# EAGLE schematic circuito_tesi (EAGLE 9.6.2)
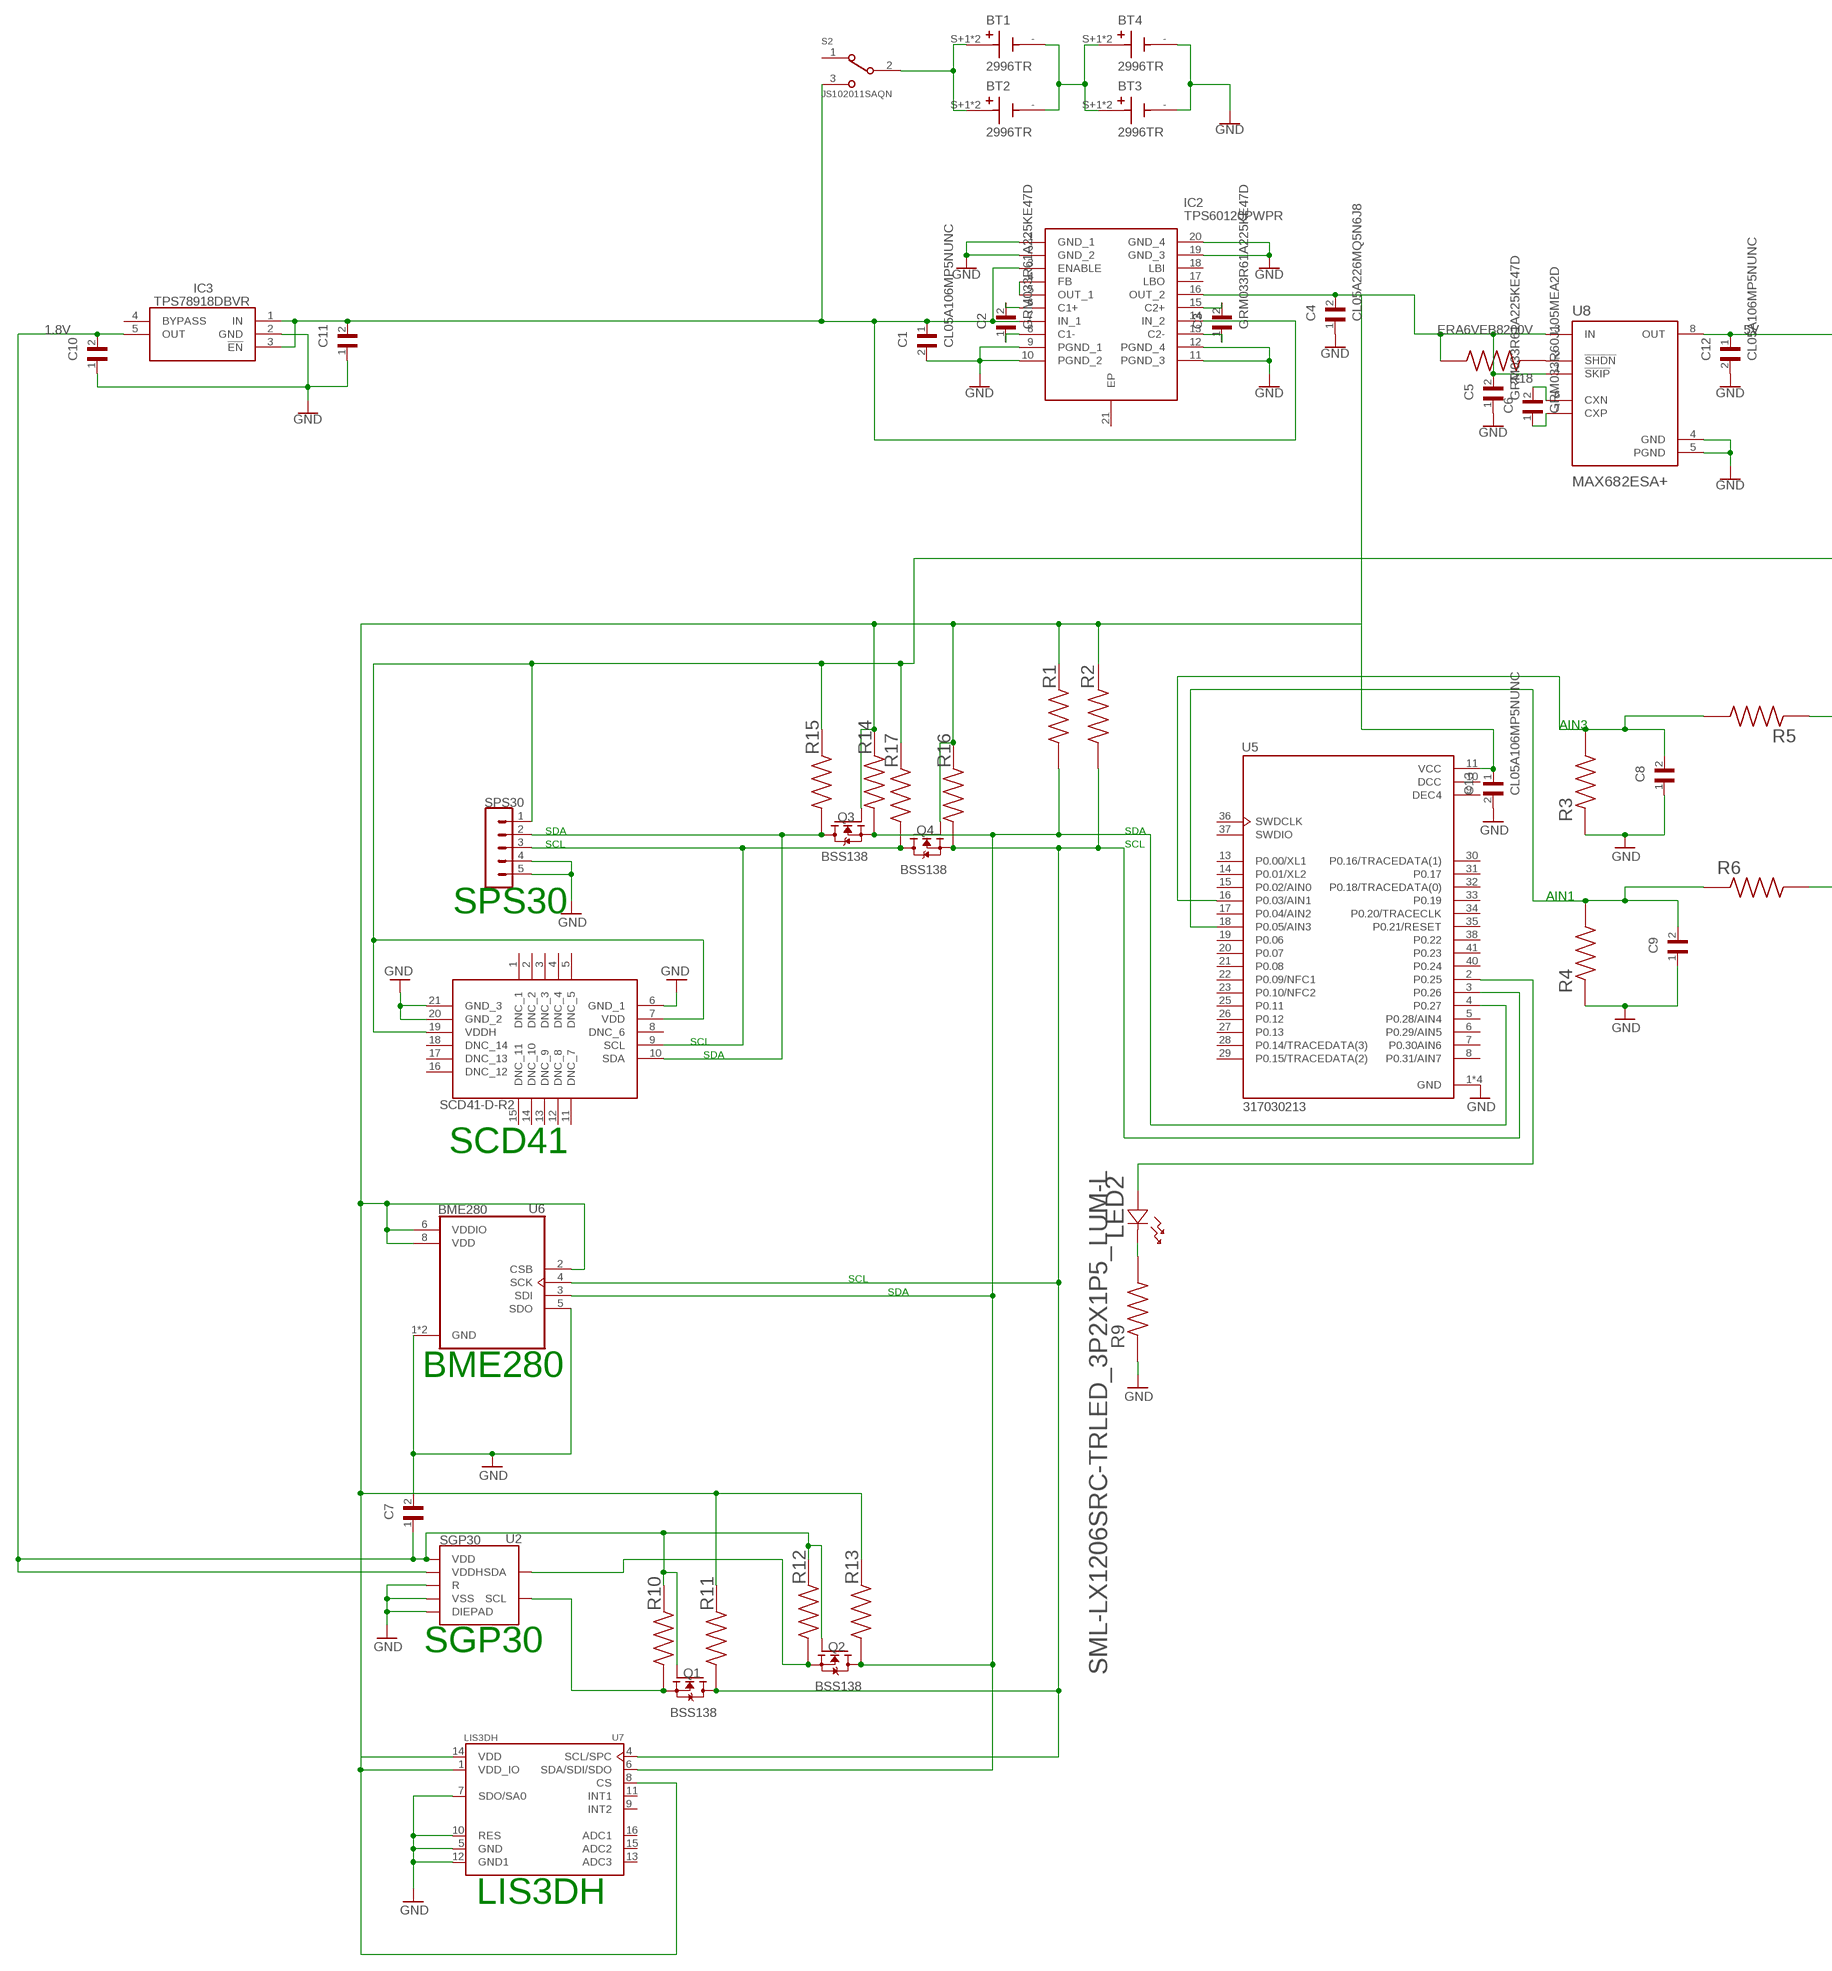
[diagram p0: schematic, sheet 1, part 1 of 2]
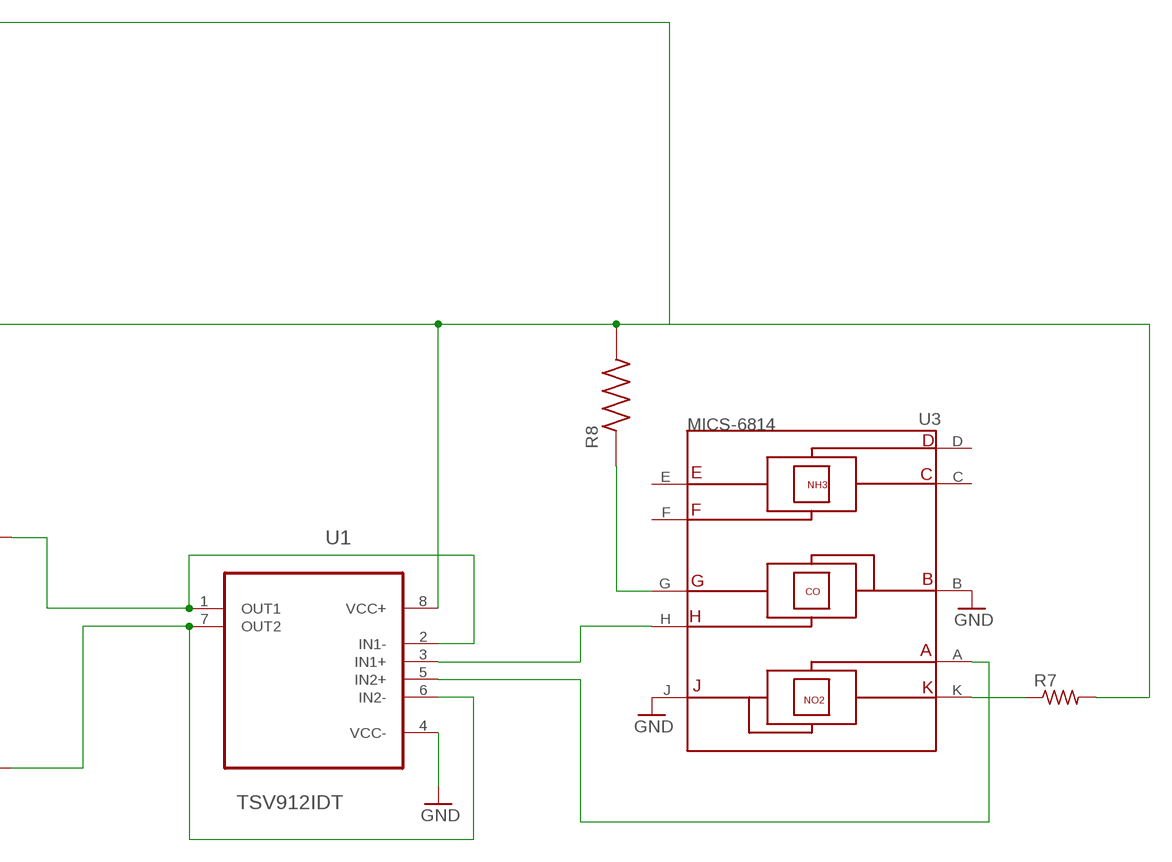
[diagram p1: schematic, sheet 1, part 2 of 2]

## Parts
BT1  2996TR  [BAT_2996TR]
BT2  2996TR  [BAT_2996TR]
BT3  2996TR  [BAT_2996TR]
BT4  2996TR  [BAT_2996TR]
C1  CL05A106MP5NUNC  [CAPC1005X55N]
C2  GRM033R61A225KE47D  [CAPC0603X39N]
C3  GRM033R61A225KE47D  [CAPC0603X39N]
C4  CL05A226MQ5N6J8  [CAPC1005X55N]
C5  GRM033R61A225KE47D  [CAPC0603X39N]
C6  GRM033R60J105MEA2D  [CAPC0603X35N]
C7  GRM033C80J104KE15D  [CAPC0603X33N]
C8  GRM033R60J103KA01D  [CAPC0603X33N]
C9  GRM033R60J103KA01D  [CAPC0603X33N]
C10  GRM033R60J105MEA2D  [CAPC0603X35N]
C11  GRM033R60J105MEA2D  [CAPC0603X35N]
C12  CL05A106MP5NUNC  [CAPC1005X55N]
C13  CL05A106MP5NUNC  [CAPC1005X55N]
IC1  SCD41-D-R2  [SCD41DR2]
IC2  TPS60120PWPR  [SOP65P640X120-21N]
IC3  TPS78918DBVR  [SOT95P280X145-5N]
LED2  SML-LX1206SRC-TRLED_3P2X1P5_LUM-L  [LED_3P2X1P5_LUM-L]
Q1  BSS138  [SOT95P240X111-3N]
Q2  BSS138  [SOT95P240X111-3N]
Q3  BSS138  [SOT95P240X111-3N]
Q4  BSS138  [SOT95P240X111-3N]
R1  RNCP0805FTD10K0  [RESC2012X60N]
R2  RNCP0805FTD10K0  [RESC2012X60N]
R3  RMCF0603FT10M0  [RESC1508X55N]
R4  RMCF0603FT10M0  [RESC1508X55N]
R5  RMCF0603FT5M10  [RESC1508X55N]
R6  RMCF0603FT5M10  [RESC1508X55N]
R7  RP73PF2A130RBTDF  [RESC2012X65N]
R8  ERA6VEB8200V  [RES_ERA6VEB8200V]
R9  RNCF0603DTE820R  [RESC1508X55N]
R10  RNCP0805FTD10K0  [RESC2012X60N]
R11  RNCP0805FTD10K0  [RESC2012X60N]
R12  RNCP0805FTD10K0  [RESC2012X60N]
R13  RNCP0805FTD10K0  [RESC2012X60N]
R14  RNCP0805FTD10K0  [RESC2012X60N]
R15  RNCP0805FTD10K0  [RESC2012X60N]
R16  RNCP0805FTD10K0  [RESC2012X60N]
R17  RNCP0805FTD10K0  [RESC2012X60N]
R18  ERA6VEB8200V  [RES_ERA6VEB8200V]
S2  JS102011SAQN  [SW_JS102011SAQN]
SPS30  MA05-1  [MA05-1]
U1  TSV912IDT  [SOIC127P600X175-8N]
U2  SGP30  [SGP30]
U3  MICS-6814  [SENSOR_MICS-6814]
U5  317030213  [XCVR_317030213]
U6  BME280  [PSON65P250X250X100-8N]
U7  LIS3DH  [PQFN50P300X300X100-16N]
U8  MAX682ESA+  [SOIC127P600X175-8N]

## Nets
1.8V: C7.1 C10.2 IC3.5(OUT) Q1.1(G) Q2.1(G) R10.2 R12.2 U2.1(VDD) U2.5(VDDH)
3.3: C4.2 C5.2 C13.1 IC2.16(OUT_2) Q3.1(G) Q4.1(G) R1.2 R2.2 R11.2 R13.2 R14.2 R16.2 R18.2 U5.11(VCC) U6.2(CSB) U6.6(VDDIO) U6.8(VDD) U7.1(VDD_IO) U7.8(CS) U7.14(VDD) U8.1(!SKIP) U8.3(IN)
5V: C12.1 IC1.7(VDD) IC1.19(VDDH) R7.2 R8.2 R15.2 R17.2 SPS30.1 U1.8(VCC+) U8.8(OUT)
GND: BT3.- BT4.- C1.2 C4.1 C5.1 C7.2 C8.1 C9.1 C10.1 C11.1 C12.2 C13.2 IC1.6(GND_1) IC1.20(GND_2) IC1.21(GND_3) IC2.1(GND_1) IC2.2(GND_2) IC2.9(PGND_1) IC2.10(PGND_2) IC2.11(PGND_3) IC2.12(PGND_4) IC2.19(GND_3) IC2.20(GND_4) IC3.2(GND) R3.1 R4.1 R9.1 SPS30.4 SPS30.5 U1.4(VCC-) U2.2(VSS) U2.4(R) U2.DIEPAD U3.B(RH1/RS1_RED) U3.J(RH1/RS1_OX) U5.1(GND) U5.12(GND) U5.24(GND) U5.39(GND) U6.1(GND) U6.5(SDO) U6.7(GND) U7.5(GND) U7.7(SDO/SA0) U7.10(RES) U7.12(GND1) U8.4(GND) U8.5(PGND)
N$1: IC1.10(SDA) Q3.3(D) R15.1 SPS30.2
N$2: BT1.S+1(+) BT1.S+2(+) BT2.S+1(+) BT2.S+2(+) S2.2
N$3: IC1.9(SCL) Q4.3(D) R17.1 SPS30.3
N$4: BT1.- BT2.- BT3.S+1(+) BT3.S+2(+) BT4.S+1(+) BT4.S+2(+)
N$5: R6.2 U1.6(IN2-) U1.7(OUT2)
N$6: U1.5(IN2+) U3.A(RS2)
N$7: C2.2 IC2.6(C1+)
N$8: R5.1 U1.1(OUT1) U1.2(IN1-)
N$9: LED2.1(ANODE) R9.2
N$10: U1.3(IN1+) U3.H(RS2_RED)
N$11: R8.1 U3.G(RH2_RED)
N$12: C2.1 IC2.8(C1-)
N$13: R7.1 U3.K(RH2_OX)
N$14: C3.2 IC2.15(C2+)
N$15: C9.2 R4.2 R6.1 U5.18(P0.05/AIN3)
N$16: Q2.2(S) R12.1 U2.3(SDA)
N$17: C8.2 R3.2 R5.2 U5.16(P0.03/AIN1)
N$18: C3.1 IC2.13(C2-)
N$19: IC2.4(FB) IC2.5(OUT_1)
N$20: C6.2 U8.6(CXN)
N$21: LED2.2(CATHODE) U5.2(P0.25)
N$22: C6.1 U8.7(CXP)
N$23: Q1.2(S) R10.1 U2.6(SCL)
N$24: R18.1 U8.2(!SHDN)
SCL: Q1.3(D) Q4.2(S) R2.1 R11.1 R16.1 U5.3(P0.26) U6.4(SCK) U7.4(SCL/SPC)
SDA: Q2.3(D) Q3.2(S) R1.1 R13.1 R14.1 U5.4(P0.27) U6.3(SDI) U7.6(SDA/SDI/SDO)
VDD: C1.1 C11.2 IC2.3(ENABLE) IC2.7(IN_1) IC2.14(IN_2) IC3.1(IN) IC3.3(!EN) S2.3
Unconnected: IC1.1(DNC_1) IC1.2(DNC_2) IC1.3(DNC_3) IC1.4(DNC_4) IC1.5(DNC_5) IC1.8(DNC_6) IC1.11(DNC_7) IC1.12(DNC_8) IC1.13(DNC_9) IC1.14(DNC_10) IC1.15(DNC_11) IC1.16(DNC_12) IC1.17(DNC_13) IC1.18(DNC_14) IC2.17(LBO) IC2.18(LBI) IC2.21(EP) IC3.4(BYPASS) S2.1 U3.C(RH1_NH3) U3.D(RS1_NH3) U3.E(RH2_NH3) U3.F(RS2_NH3) U5.5(P0.28/AIN4) U5.6(P0.29/AIN5) U5.7(P0.30AIN6) U5.8(P0.31/AIN7) U5.13(P0.00/XL1) U5.14(P0.01/XL2) U5.15(P0.02/AIN0) U5.17(P0.04/AIN2) U5.19(P0.06) U5.20(P0.07) U5.21(P0.08) U5.22(P0.09/NFC1) U5.23(P0.10/NFC2) U5.25(P0.11) U5.26(P0.12) U5.27(P0.13) U5.28(P0.14/TRACEDATA(3)) U5.29(P0.15/TRACEDATA(2)) U5.30(P0.16/TRACEDATA(1)) U5.31(P0.17) U5.32(P0.18/TRACEDATA(0)) U5.33(P0.19) U5.34(P0.20/TRACECLK) U5.35(P0.21/RESET) U5.36(SWDCLK) U5.37(SWDIO) U5.38(P0.22) U5.40(P0.24) U5.41(P0.23) U7.9(INT2) U7.11(INT1) U7.13(ADC3) U7.15(ADC2) U7.16(ADC1)

## Notes on the sheet
- AIN3
- SDA | SDA
- SCL | SCL
- AIN1
- SPS30
- SCL
- SDA
- SCD41
- SCL
- SDA
- BME280
- SGP30
- LIS3DH

## Power pins joined to a net without a drawn wire
DCC: U5.10(DCC)
DEC4: U5.9(DEC4)

## Library data of the parts
BT1-BT4 = Battery_holder:2996TR: Battery Retainer Coin, 11.6mm 1 Cell SMD (SMT) Tab; DESCRIPTION: SMT Holder for 11.6mm Cell-Tin Nickel Plated on T&R; DIGI-KEY_PART_NUMBER: 36-2996TR-ND; MF: Keystone Electronics; MP: 2996TR; PACKAGE: None; PURCHASE-URL: https://pricing.snapeda.com/search/part/2996TR/?ref=eda
C1 C12 C13 = Condens_10uF:CL05A106MP5NUNC: Cap Ceramic 10uF 10V X5R 20% SMD 0402 85C T/R; DESCRIPTION: 10 µF ±20% 10V Ceramic Capacitor X5R 0402 (1005 Metric); DIGI-KEY_PART_NUMBER: 1276-1450-2-ND; MF: Samsung; MP: CL05A106MP5NUNC; PACKAGE: 0402 Samsung; PURCHASE-URL: https://pricing.snapeda.com/search/part/CL05A106MP5NUNC/?ref=eda
C2 C3 C5 = Condens_2.2uF:GRM033R61A225KE47D: SMD Capacitor X5R(EIA) with Capacitance: 2.2uF Tol. 10%. Rated Voltage: 10Vdc; DESCRIPTION: 2.2 µF ±10% 10V Ceramic Capacitor X5R 0201 (0603 Metric); DIGI-KEY_PART_NUMBER: 490-13227-2-ND; MF: Murata Electronics; MP: GRM033R61A225KE47D; PACKAGE: None; PURCHASE-URL: https://pricing.snapeda.com/search/part/GRM033R61A225KE47D/?ref=eda
C4 = Condens_22uF:CL05A226MQ5N6J8: Cap Ceramic 22uF 6.3V X5R 20% Pad SMD 0402 85C T/R; DESCRIPTION: 22 µF ±20% 6.3V Ceramic Capacitor X5R 0402 (1005 Metric); DIGI-KEY_PART_NUMBER: 1276-7090-2-ND; MF: Samsung Electro-Mechanics; MP: CL05A226MQ5N6J8; PACKAGE: 0402 Samsung Electro-Mechanics; PURCHASE-URL: https://pricing.snapeda.com/search/part/CL05A226MQ5N6J8/?ref=eda
C6 C10 C11 = Condens_1uF:GRM033R60J105MEA2D: SMD Capacitor X5R(EIA) with Capacitance: 1.0uF Tol. 20%. Rated Voltage: 6.3Vdc; DESCRIPTION: SMD capacitor X5R(EIA) with capacitance 1.0uF Tol.20%. Rated voltage 6.3Vdc 85C; DIGI-KEY_PART_NUMBER: 490-7229-2-ND; MF: Murata; MP: GRM033R60J105MEA2D; PACKAGE: 0603 Taiyo Yuden; PURCHASE-URL: https://pricing.snapeda.com/search/part/GRM033R60J105MEA2D/?ref=eda
C7 = Condens_100nF:GRM033C80J104KE15D: SMD Capacitor X6S(EIA) with Capacitance: 0.10uF Tol. 10%. Rated Voltage: 6.3Vdc; DESCRIPTION: SMD capacitor X6S(EIA) with capacitance 0.10uF Tol.10%. Rated voltage 6.3Vdc 105C; DIGI-KEY_PART_NUMBER: 490-10390-2-ND; MF: Murata Electronics; MP: GRM033C80J104KE15D; PACKAGE: 0603 Taiyo Yuden; PURCHASE-URL: https://pricing.snapeda.com/search/part/GRM033C80J104KE15D/?ref=eda
C8 C9 = Condens_10nF:GRM033R60J103KA01D: SMD Capacitor X5R(EIA) with Capacitance: 10000pF Tol. 10%. Rated Voltage: 6.3Vdc; DESCRIPTION: SMD capacitor X5R(EIA) with capacitance 10000pF Tol.10%. Rated voltage 6.3Vdc 85C; DIGI-KEY_PART_NUMBER: 490-5403-2-ND; MF: Murata; MP: GRM033R60J103KA01D; PACKAGE: 0603 Taiyo Yuden; PURCHASE-URL: https://pricing.snapeda.com/search/part/GRM033R60J103KA01D/?ref=eda
IC1 = SCD41-R2_unofficial:SCD41-D-R2: Air Quality Sensor CO2 Sensor 2.5V/3.3V/5V 20-Pin SMD EP Source: Datasheet <https://cz.mouser.com/datasheet/2/682/Sensirion_CO2_Sensors_SCD4x_Datasheet-2010009.pdf>; ARROW_PART_NUMBER: SCD41-D-R2; ARROW_PRICE-STOCK: https://www.arrow.com/en/products/scd41-d-r2/sensirion-ag?region=nac; DESCRIPTION: Air Quality Sensor CO2 Sensor 2.5V/3.3V/5V 20-Pin SMD EP; HEIGHT: 6.8mm; MANUFACTURER_NAME: Sensirion; MANUFACTURER_PART_NUMBER: SCD41-D-R2; MOUSER_PART_NUMBER: 403-SCD41-D-R2; MOUSER_PRICE-STOCK: https://www.mouser.co.uk/ProductDetail/Sensirion/SCD41-D-R2?qs=HBWAp0VN4Ri4o7ei4T3s0g%3D%3D
IC2 = C_P_3.3_TPS60120PWPR:TPS60120PWPR: Charge Pump Switching Regulator IC Positive Fixed 3.3V 1 Output 200mA 20-PowerTSSOP (0.173", 4.40mm Width) Source: Datasheet <http://www.ti.com/lit/ds/symlink/tps60120.pdf>; ARROW_PART_NUMBER: TPS60120PWPR; ARROW_PRICE-STOCK: https://www.arrow.com/en/products/tps60120pwpr/texas-instruments; DESCRIPTION: Charge Pump Switching Regulator IC Positive Fixed 3.3V 1 Output 200mA 20-PowerTSSOP (0.173", 4.40mm Width); HEIGHT: 1.2mm; MANUFACTURER_NAME: Texas Instruments; MANUFACTURER_PART_NUMBER: TPS60120PWPR; MOUSER_PART_NUMBER: 595-TPS60120PWPR; MOUSER_PRICE-STOCK: https://www.mouser.co.uk/ProductDetail/Texas-Instruments/TPS60120PWPR?qs=Gse6rAGbi79DzmdCulofrg%3D%3D
IC3 = V_REG_1.8_SOT-23-5:TPS78918DBVR: 10-V, 100-mA, Low Iq, Low Noise, Low-Dropout Linear Regulator Source: Datasheet <http://www.ti.com/lit/gpn/tps789>; ARROW_PART_NUMBER: TPS78918DBVR; ARROW_PRICE-STOCK: https://www.arrow.com/en/products/tps78918dbvr/texas-instruments; DESCRIPTION: 10-V, 100-mA, Low Iq, Low Noise, Low-Dropout Linear Regulator; HEIGHT: 1.45mm; MANUFACTURER_NAME: Texas Instruments; MANUFACTURER_PART_NUMBER: TPS78918DBVR; MOUSER_PART_NUMBER: 595-TPS78918DBVR; MOUSER_PRICE-STOCK: https://www.mouser.com/Search/Refine.aspx?Keyword=595-TPS78918DBVR
LED2 = LED_SMD:SML-LX1206SRC-TR; COPYRIGHT: Copyright (C) 2022 Ultra Librarian. All rights reserved.; DIGI-KEY_PART_NUMBER_1: 67-1359-2-ND; DIGI-KEY_PART_NUMBER_2: 67-1359-1-ND; DIGI-KEY_PART_NUMBER_3: 67-1359-6-ND; DIGI-KEY_PART_NUMBER_4: 67-1359-2-NDL; MANUFACTURER_PART_NUMBER: SML-LX1206SRC-TR; MFR_NAME: Lumex
Q1-Q4 = BSS138:BSS138: N-Channel 50V 220mA (Ta) 360mW (Ta) Surface Mount SOT-23-3; DESCRIPTION: N-Channel 50 V 200mA (Ta) 225mW (Ta) Surface Mount SOT-23-3 (TO-236); DIGI-KEY_PART_NUMBER: BSS138TR-ND; MF: ON Semiconductor; MP: BSS138; PACKAGE: SOT-23 ON; PURCHASE-URL: https://pricing.snapeda.com/search/part/BSS138/?ref=eda
R1 R2 R10-R17 = Res_10K_0p25W:RNCP0805FTD10K0; DESCRIPTION: 10 kOhms ±1% 0.25W, 1/4W Chip Resistor 0805 (2012 Metric) Anti-Sulfur, Moisture Resistant Thin Film; DIGI-KEY_PART_NUMBER: RNCP0805FTD10K0TR-ND; MF: Stackpole Electronics Inc; MP: RNCP0805FTD10K0; PACKAGE: 2012 Stackpole; PURCHASE-URL: https://pricing.snapeda.com/search/part/RNCP0805FTD10K0/?ref=eda
R3 R4 = Res_10MOHM_2:RMCF0603FT10M0; DESCRIPTION: 10 MOhms ±1% 0.1W, 1/10W Chip Resistor 0603 (1608 Metric) Automotive AEC-Q200 Thick Film; DIGI-KEY_PART_NUMBER: RMCF0603FT10M0TR-ND; MF: Stackpole Electronics Inc; MP: RMCF0603FT10M0; PACKAGE: 1508 Stackpole; PURCHASE-URL: https://pricing.snapeda.com/search/part/RMCF0603FT10M0/?ref=eda
R5 R6 = Res_5.1MOHM:RMCF0603FT5M10; DESCRIPTION: 5.1 MOhms ±1% 0.1W, 1/10W Chip Resistor 0603 (1608 Metric) Automotive AEC-Q200 Thick Film; DIGI-KEY_PART_NUMBER: RMCF0603FT5M10TR-ND; MF: Stackpole Electronics Inc; MP: RMCF0603FT5M10; PACKAGE: 1508 Stackpole; PURCHASE-URL: https://pricing.snapeda.com/search/part/RMCF0603FT5M10/?ref=eda
R7 = Res_130_0p25:RP73PF2A130RBTDF: RES, THIN FILM, 130R, 0.1%, 0.25W, 0805; DESCRIPTION: Surface Mount Thin Film Resistor, RP73 Series, 130 ohm, 250 mW, - 0.1%, 150 V; MF: TE Connectivity; MP: RP73PF2A130RBTDF; PACKAGE: 0805 TE Connectivity; PURCHASE-URL: https://pricing.snapeda.com/search/part/RP73PF2A130RBTDF/?ref=eda
R8 R18 = Res_820_0p25W:ERA6VEB8200V; DESCRIPTION: Thin Film Chip Resistors, High Stability and Reliability Type, ERA6V Series, 0.82K Ohm +/-0.1% , 0.25W , 0805 size , chip resistor (2 x 1.25 x 0.55mm); DIGI-KEY_PART_NUMBER: 10-ERA-6VEB8200VTR-ND; MF: Panasonic; MP: ERA6VEB8200V; PACKAGE: 2012-2 Panasonic; PURCHASE-URL: https://pricing.snapeda.com/search/part/ERA6VEB8200V/?ref=eda
R9 = Res_820OHM:RNCF0603DTE820R; DESCRIPTION: 820 ±0.5% 0.1W, 1/10W Chip Resistor 0603 (1608 Metric) Automotive AEC-Q200 Thin Film; DIGI-KEY_PART_NUMBER: RNCF0603DTE820RTR-ND; MF: Stackpole Electronics Inc; MP: RNCF0603DTE820R; PACKAGE: 1508 Stackpole; PURCHASE-URL: https://pricing.snapeda.com/search/part/RNCF0603DTE820R/?ref=eda
S2 = switch_JS102011SAQN:JS102011SAQN: JS10 Series SPDT On-On 6 V 0.3 A Gull Wing SMT Slide Switch http://www.snapeda.com/parts/JS102011SAQN/C%26K%20Components/view-part/; DESCRIPTION: Slide Switch SPDT Surface Mount, Right Angle; DIGI-KEY_PART_NUMBER: 401-1999-2-ND; MF: C&K; MP: JS102011SAQN; PACKAGE: None; PURCHASE-URL: https://pricing.snapeda.com/search/part/JS102011SAQN/?ref=eda
SPS30 = con-lstb:MA05-1: PIN HEADER; OC_FARNELL: unknown; OC_NEWARK: unknown
U1 = Opamp_SMD:TSV912IDT: operational amplifiers Check availability <https://pricing.snapeda.com/parts/TSV912IDT/STMicroelectronics/view-part?ref=eda>; AVAILABILITY: In Stock; DESCRIPTION: General Purpose Amplifier 2 Circuit Rail-to-Rail 8-SOIC; MF: STMicroelectronics; MP: TSV912IDT; PACKAGE: SOIC-8 STMicroelectronics; PRICE: None; PURCHASE-URL: https://pricing.snapeda.com/search/part/TSV912IDT/?ref=eda
U2 = SGP30:SGP30: The SGP30 is a digital multi-pixel gas sensor designed for easy integration into air purifier, demand-controlled ventilation, and IoT applications. Check availability <https://pricing.snapeda.com/parts/SGP30/Sensirion%20AG/view-part?ref=eda>; AVAILABILITY: In Stock; DESCRIPTION: SGP30, SHTC1 Air Quality, Humidity, Temperature Sensor Arduino Platform Evaluation Expansion Board; MF: Sensirion AG; MP: SGP30; PACKAGE: None; PRICE: None; PURCHASE-URL: https://pricing.snapeda.com/search/part/SGP30/?ref=eda
U3 = MICS-6814:MICS-6814: Three gas SMD NH3, CO and NO2 Check availability <https://pricing.snapeda.com/parts/MICS-6814/MikroElektronika/view-part?ref=eda>; AVAILABILITY: Not in stock; DESCRIPTION: MiCS-6814 Air Quality Sensor mikroBUS™ Click™ Platform Evaluation Expansion Board; MF: MikroElektronika; MP: MICS-6814; PACKAGE: None; PRICE: None
U5 = Raytac_nRF52:317030213: Mdbt42q Nrf52832 Based BLE Module; DESCRIPTION: Bluetooth Bluetooth v4.2 Transceiver Module 2.4GHz Integrated, Chip Surface Mount; DIGI-KEY_PART_NUMBER: 1597-1434-ND; MF: Seeed Technology; MP: 317030213; PACKAGE: SMD-41 Seeed Studio; PURCHASE-URL: https://pricing.snapeda.com/search/part/317030213/?ref=eda
U6 = BME280:BME280: DIGITAL HUMIDITY, PRESSURE AND TEMPERATURE SENSOR * Digital interface I²C (up to 3.4 MHz) and SPI (3 and 4 wire, up to 10 MHz)* Supply voltage VDD main supply voltage range: 1.71 V to 3.6 V*VDDIO interface voltage range: 1.2 V to 3.6 V Operating range -40…+85 °C, 0…100 % rel. humidity, 300…1100 hPa The library has been designed by Richard Magdycz <https://www.facebook.com/groups/eaglecadsoftUK> Check availability <https://pricing.snapeda.com/parts/BME280/Bosch/view-part?ref=eda>; AVAILABILITY: In Stock; DESCRIPTION: Board Mount Humidity Sensors MEMS humidity, pressure and temperature sensor; MF: Bosch; MP: BME280; PACKAGE: LGA-8 Bosch; PRICE: None; PURCHASE-URL: https://pricing.snapeda.com/search/part/BME280/?ref=eda
U7 = LIS3DH:LIS3DH: MEMS digital output motion sensor ultra low-power high performance 3-axes "nano" accelerometer; DESCRIPTION: Accelerometer X, Y, Z Axis ±2g, 4g, 8g, 16g 0.5Hz ~ 625Hz 16-LGA (3x3); DIGI-KEY_PART_NUMBER: 497-10610-ND; MF: STMicroelectronics; MP: LIS3DH; PACKAGE: LGA-16 STMicroelectronics; PURCHASE-URL: https://pricing.snapeda.com/search/part/LIS3DH/?ref=eda
U8 = C_P_5_MAX682ESA_:MAX682ESA+: None; DESCRIPTION: Charge Pump Switching Regulator IC Positive Fixed 5V 1 Output 250mA 8-SOIC (0.154, 3.90mm Width); DIGI-KEY_PART_NUMBER: MAX682ESA+-ND; MF: Maxim Integrated; MP: MAX682ESA+; PACKAGE: SOIC-8 Maxim; PURCHASE-URL: https://pricing.snapeda.com/search/part/MAX682ESA+/?ref=eda